# Altium schematic sheet C-08 SODIMM.SchDoc
size 513 x 386 mm
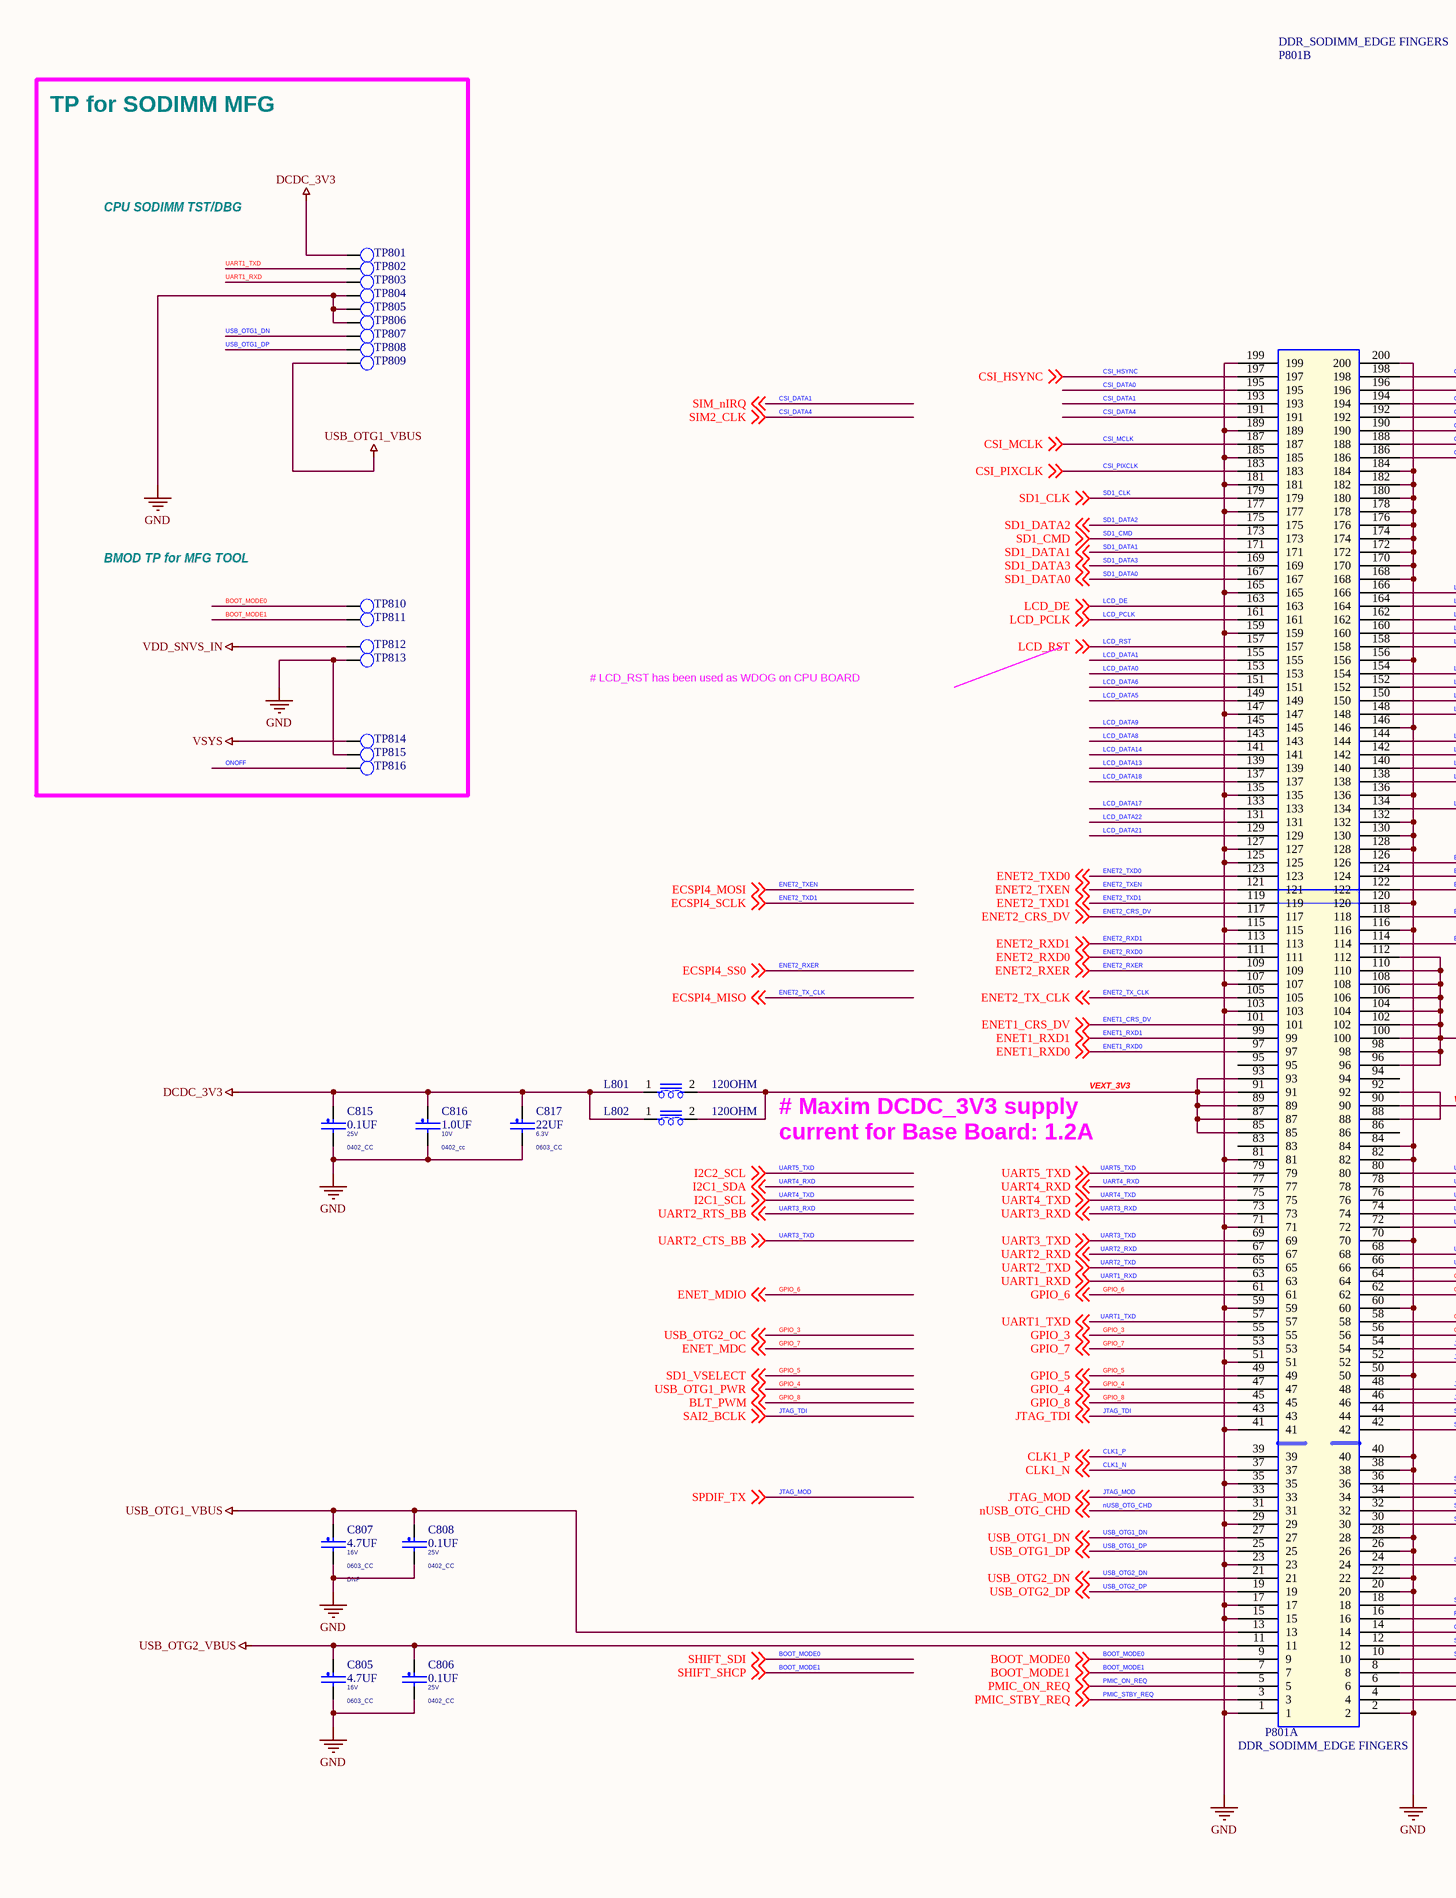
[diagram p0: C-08 SODIMM.SchDoc, left]
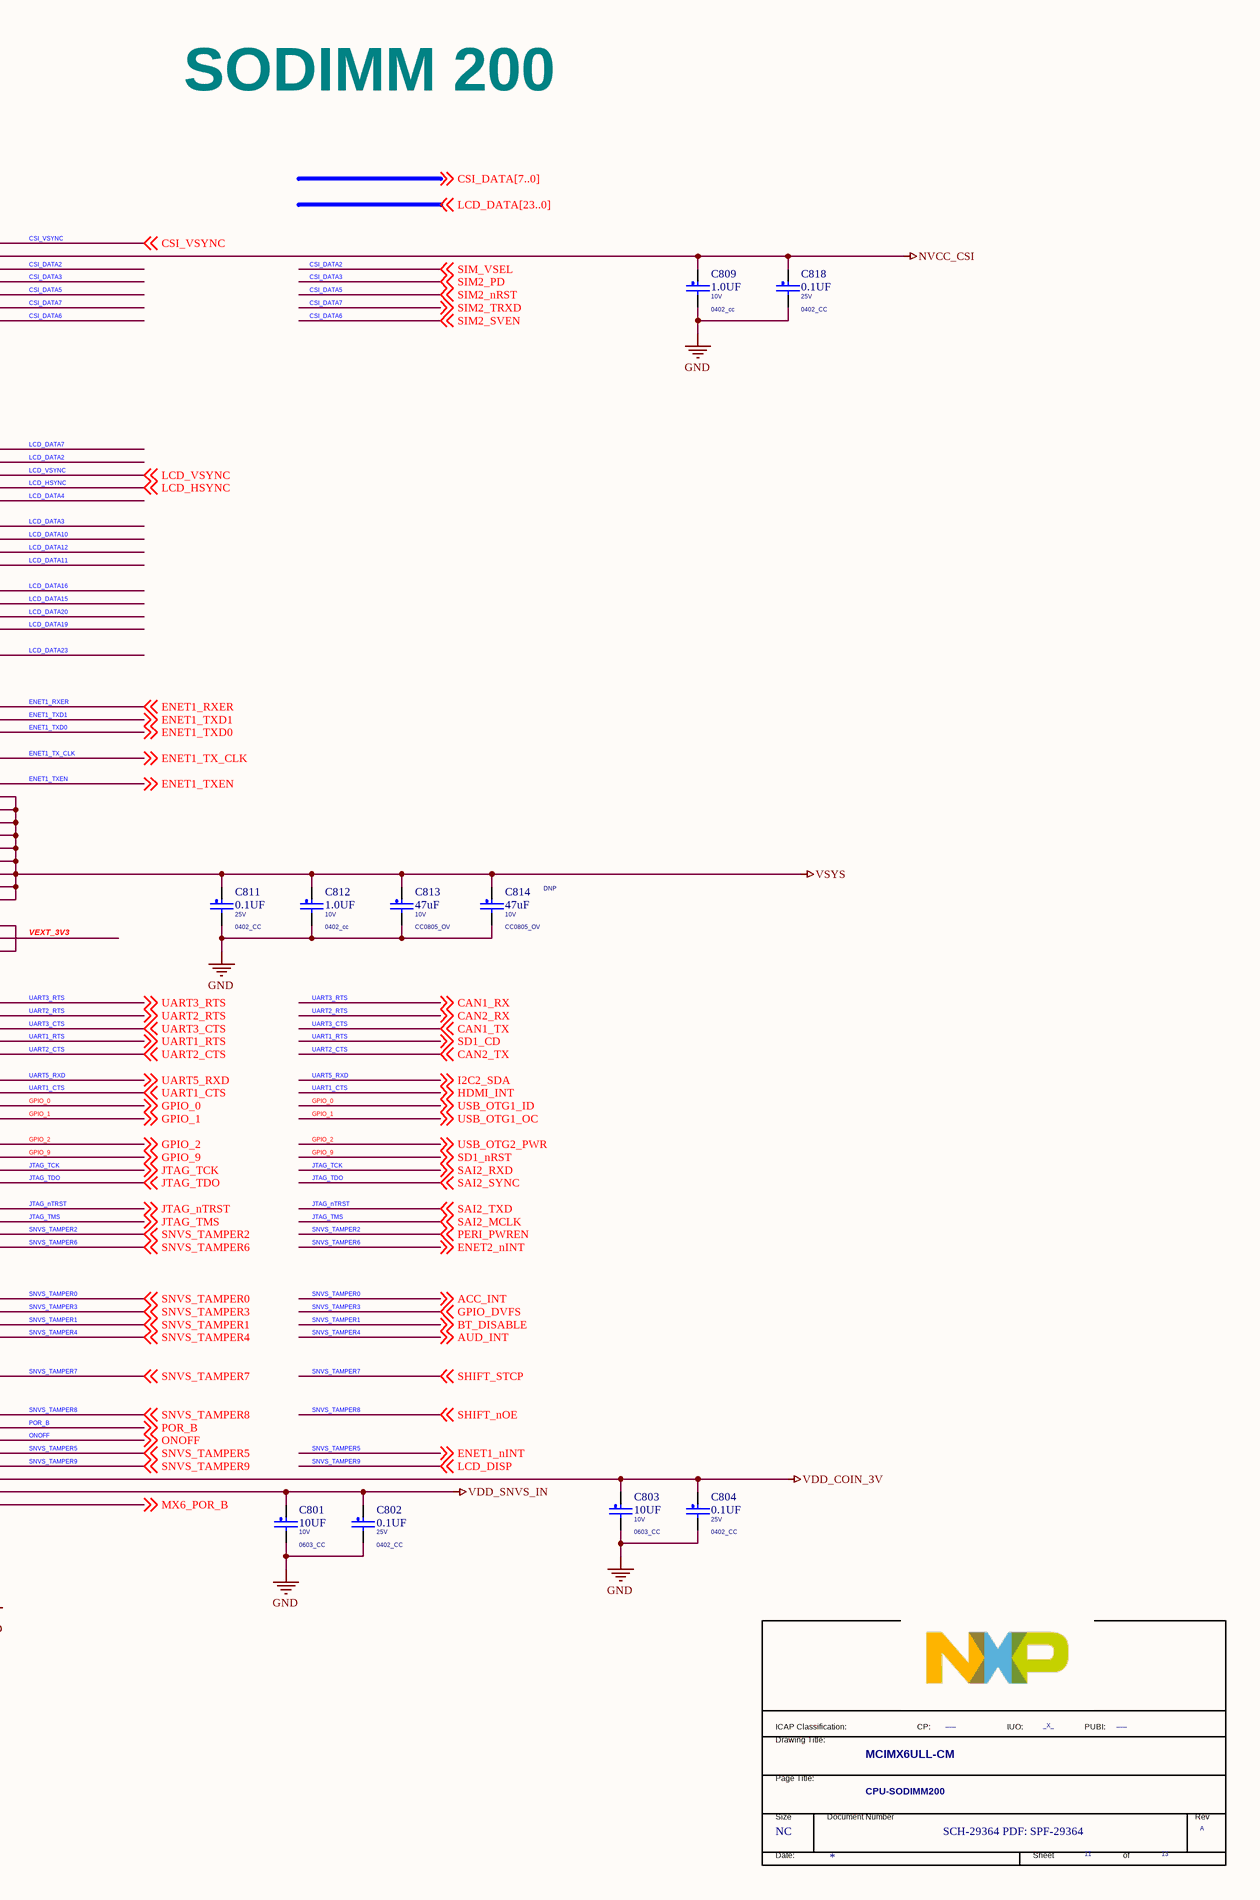
[diagram p1: C-08 SODIMM.SchDoc, right]

## Parts
*  FIUO: _X_  PUBI: ___  Doc: SCH-29364 PDF: SPF-29364  RevCode: A  Title: MCIMX6ULL-CM  Page Size: NC  Page Number: 11  Page Count: 13  PageTitle: CPU-SODIMM200  (hidden comment: TitleBlock_FS)  (graphical)
C801  10UF  VOLTAGE: 10V  PCB Footprint: 0603_CC  [C0603_H0.8mm_IPC_C]
C802  0.1UF  VOLTAGE: 25V  PCB Footprint: 0402_CC  [C0402_H0.5mm]
C803  10UF  VOLTAGE: 10V  PCB Footprint: 0603_CC  [C0603_H0.8mm_IPC_C]
C804  0.1UF  VOLTAGE: 25V  PCB Footprint: 0402_CC  [C0402_H0.5mm]
C805  4.7UF  VOLTAGE: 16V  PCB Footprint: 0603_CC  [C0603_H0.8mm_IPC_C]
C806  0.1UF  VOLTAGE: 25V  PCB Footprint: 0402_CC  [C0402_H0.5mm]
C807  4.7UF  PCB Footprint: 0603_CC  VOLTAGE: 16V  ASSY_OPT: DNP  [C0603_H0.8mm_IPC_C]
C808  0.1UF  VOLTAGE: 25V  PCB Footprint: 0402_CC  [C0402_H0.5mm]
C809  1.0UF  VOLTAGE: 10V  PCB Footprint: 0402_cc  [C0402_H0.5mm]
C811  0.1UF  VOLTAGE: 25V  PCB Footprint: 0402_CC  [C0402_H0.5mm]
C812  1.0UF  VOLTAGE: 10V  PCB Footprint: 0402_cc  [C0402_H0.5mm]
C813  47uF  VOLTAGE: 10V  [CC0805_OV]
C814  47uF  VOLTAGE: 10V  ASSY_OPT: DNP  [CC0805_OV]
C815  0.1UF  VOLTAGE: 25V  PCB Footprint: 0402_CC  [C0402_H0.5mm]
C816  1.0UF  VOLTAGE: 10V  PCB Footprint: 0402_cc  [C0402_H0.5mm]
C817  22UF  voltage rating: 6.3V  PCB Footprint: 0603_CC  [C0603_H0.8mm_IPC_C]
C818  0.1UF  VOLTAGE: 25V  PCB Footprint: 0402_CC  [C0402_H0.5mm]
L801  120OHM  [0603_CC]
L802  120OHM  [0603_CC]
P801  DDR_SODIMM_EDGE FINGERS  [SODIMM_67589]  (parts A,B of 2)
TP801  TP_35MIL  [testpoint_35mil]  (value not drawn)
TP802  TP_35MIL  [testpoint_35mil]  (value not drawn)
TP803  TP_35MIL  [testpoint_35mil]  (value not drawn)
TP804  TP_35MIL  [testpoint_35mil]  (value not drawn)
TP805  TP_35MIL  [testpoint_35mil]  (value not drawn)
TP806  TP_35MIL  [testpoint_35mil]  (value not drawn)
TP807  TP_35MIL  [testpoint_35mil]  (value not drawn)
TP808  TP_35MIL  [testpoint_35mil]  (value not drawn)
TP809  TP_35MIL  [testpoint_35mil]  (value not drawn)
TP810  TP_35MIL  [testpoint_35mil]  (value not drawn)
TP811  TP_35MIL  [testpoint_35mil]  (value not drawn)
TP812  TP_35MIL  [testpoint_35mil]  (value not drawn)
TP813  TP_35MIL  [testpoint_35mil]  (value not drawn)
TP814  TP_35MIL  [testpoint_35mil]  (value not drawn)
TP815  TP_35MIL  [testpoint_35mil]  (value not drawn)
TP816  TP_35MIL  [testpoint_35mil]  (value not drawn)

## Blocks framed on the sheet
TP for SODIMM MFG: TP801-TP816

## Nets
DCDC_3V3: C815.1 C816.1 C817.1 L801.1 L802.1 TP801.1(TP)
GND: C801.2 C802.2 C803.2 C804.2 C805.2 C806.2 C807.2 C808.2 C809.2 C811.2 C812.2 C813.2 C814.2 C815.2 C816.2 C817.2 C818.2 P801.1 P801.2 P801.15 P801.17 P801.20 P801.22 P801.23 P801.26 P801.28 P801.29 P801.35 P801.38 P801.40 P801.41 P801.50 P801.51 P801.59 P801.60 P801.70 P801.71 P801.81 P801.82 P801.84 P801.103 P801.107 P801.115 P801.116 P801.120 P801.125 P801.127 P801.128 P801.130 P801.132 P801.135 P801.136 P801.146 P801.147 P801.156 P801.159 P801.165 P801.168 P801.170 P801.172 P801.174 P801.176 P801.177 P801.178 P801.180 P801.181 P801.182 P801.184 P801.185 P801.189 P801.199 P801.200 TP804.1(TP) TP805.1(TP) TP806.1(TP) TP813.1(TP) TP815.1(TP)
NVCC_CSI: C809.1 C818.1 P801.196
USB_OTG1_VBUS: C807.1 C808.1 P801.13 TP809.1(TP)
USB_OTG2_VBUS: C805.1 C806.1 P801.11
VDD_COIN_3V: C803.1 C804.1 P801.8
VDD_SNVS_IN: C801.1 C802.1 P801.6 TP812.1(TP)
VSYS: C811.1 C812.1 C813.1 C814.1 P801.96 P801.98 P801.100 P801.102 P801.104 P801.106 P801.108 P801.110 P801.112 TP814.1(TP)
BOOT_MODE0: P801.9 TP810.1(TP) ; off-sheet SHIFT_SDI, off-sheet BOOT_MODE0  [also labelled SHIFT_SDI]
BOOT_MODE1: P801.7 TP811.1(TP) ; off-sheet SHIFT_SHCP, off-sheet BOOT_MODE1  [also labelled SHIFT_SHCP]
CLK1_N: P801.37 ; off-sheet CLK1_N
CLK1_P: P801.39 ; off-sheet CLK1_P
CSI_DATA0: P801.195
CSI_DATA1: P801.193 ; off-sheet SIM_nIRQ  [also labelled SIM_nIRQ]
CSI_DATA2: P801.194 ; off-sheet SIM_VSEL  [also labelled SIM_VSEL]
CSI_DATA3: P801.192 ; off-sheet SIM2_PD  [also labelled SIM2_PD]
CSI_DATA4: P801.191 ; off-sheet SIM2_CLK  [also labelled SIM2_CLK]
CSI_DATA5: P801.190 ; off-sheet SIM2_nRST  [also labelled SIM2_nRST]
CSI_DATA6: P801.186 ; off-sheet SIM2_SVEN  [also labelled SIM2_SVEN]
CSI_DATA7: P801.188 ; off-sheet SIM2_TRXD  [also labelled SIM2_TRXD]
CSI_HSYNC: P801.197 ; off-sheet CSI_HSYNC
CSI_MCLK: P801.187 ; off-sheet CSI_MCLK
CSI_PIXCLK: P801.183 ; off-sheet CSI_PIXCLK
CSI_VSYNC: P801.198 ; off-sheet CSI_VSYNC
ENET1_CRS_DV: P801.101 ; off-sheet ENET1_CRS_DV
ENET1_RXD0: P801.97 ; off-sheet ENET1_RXD0
ENET1_RXD1: P801.99 ; off-sheet ENET1_RXD1
ENET1_RXER: P801.126 ; off-sheet ENET1_RXER
ENET1_TX_CLK: P801.118 ; off-sheet ENET1_TX_CLK
ENET1_TXD0: P801.122 ; off-sheet ENET1_TXD0
ENET1_TXD1: P801.124 ; off-sheet ENET1_TXD1
ENET1_TXEN: P801.114 ; off-sheet ENET1_TXEN
ENET2_CRS_DV: P801.117 ; off-sheet ENET2_CRS_DV
ENET2_RXD0: P801.111 ; off-sheet ENET2_RXD0
ENET2_RXD1: P801.113 ; off-sheet ENET2_RXD1
ENET2_RXER: P801.109 ; off-sheet ECSPI4_SS0, off-sheet ENET2_RXER  [also labelled ECSPI4_SS0]
ENET2_TX_CLK: P801.105 ; off-sheet ECSPI4_MISO, off-sheet ENET2_TX_CLK  [also labelled ECSPI4_MISO]
ENET2_TXD0: P801.123 ; off-sheet ENET2_TXD0
ENET2_TXD1: P801.119 ; off-sheet ECSPI4_SCLK, off-sheet ENET2_TXD1  [also labelled ECSPI4_SCLK]
ENET2_TXEN: P801.121 ; off-sheet ECSPI4_MOSI, off-sheet ENET2_TXEN  [also labelled ECSPI4_MOSI]
GPIO_0: P801.64 ; off-sheet USB_OTG1_ID, off-sheet GPIO_0  [also labelled USB_OTG1_ID]
GPIO_1: P801.62 ; off-sheet USB_OTG1_OC, off-sheet GPIO_1  [also labelled USB_OTG1_OC]
GPIO_2: P801.58 ; off-sheet USB_OTG2_PWR, off-sheet GPIO_2  [also labelled USB_OTG2_PWR]
GPIO_3: P801.55 ; off-sheet GPIO_3, off-sheet USB_OTG2_OC  [also labelled USB_OTG2_OC]
GPIO_4: P801.47 ; off-sheet GPIO_4, off-sheet USB_OTG1_PWR  [also labelled USB_OTG1_PWR]
GPIO_5: P801.49 ; off-sheet GPIO_5, off-sheet SD1_VSELECT  [also labelled SD1_VSELECT]
GPIO_6: P801.61 ; off-sheet GPIO_6, off-sheet ENET_MDIO  [also labelled ENET_MDIO]
GPIO_7: P801.53 ; off-sheet GPIO_7, off-sheet ENET_MDC  [also labelled ENET_MDC]
GPIO_8: P801.45 ; off-sheet GPIO_8, off-sheet BLT_PWM  [also labelled BLT_PWM]
GPIO_9: P801.56 ; off-sheet SD1_nRST, off-sheet GPIO_9  [also labelled SD1_nRST]
JTAG_MOD: P801.33 ; off-sheet JTAG_MOD, off-sheet SPDIF_TX  [also labelled SPDIF_TX]
JTAG_nTRST: P801.48 ; off-sheet SAI2_TXD, off-sheet JTAG_nTRST  [also labelled SAI2_TXD]
JTAG_TCK: P801.54 ; off-sheet SAI2_RXD, off-sheet JTAG_TCK  [also labelled SAI2_RXD]
JTAG_TDI: P801.43 ; off-sheet JTAG_TDI, off-sheet SAI2_BCLK  [also labelled SAI2_BCLK]
JTAG_TDO: P801.52 ; off-sheet SAI2_SYNC, off-sheet JTAG_TDO  [also labelled SAI2_SYNC]
JTAG_TMS: P801.46 ; off-sheet SAI2_MCLK, off-sheet JTAG_TMS  [also labelled SAI2_MCLK]
LCD_DATA0: P801.153
LCD_DATA1: P801.155
LCD_DATA2: P801.164
LCD_DATA3: P801.154
LCD_DATA4: P801.158
LCD_DATA5: P801.149
LCD_DATA6: P801.151
LCD_DATA7: P801.166
LCD_DATA8: P801.143
LCD_DATA9: P801.145
LCD_DATA10: P801.152
LCD_DATA11: P801.148
LCD_DATA12: P801.150
LCD_DATA13: P801.139
LCD_DATA14: P801.141
LCD_DATA15: P801.142
LCD_DATA16: P801.144
LCD_DATA17: P801.133
LCD_DATA18: P801.137
LCD_DATA19: P801.138
LCD_DATA20: P801.140
LCD_DATA21: P801.129
LCD_DATA22: P801.131
LCD_DATA23: P801.134
LCD_DE: P801.163 ; off-sheet LCD_DE
LCD_HSYNC: P801.160 ; off-sheet LCD_HSYNC
LCD_PCLK: P801.161 ; off-sheet LCD_PCLK
LCD_RST: P801.157 ; off-sheet LCD_RST
LCD_VSYNC: P801.162 ; off-sheet LCD_VSYNC
MX6_POR_B: P801.4 ; off-sheet MX6_POR_B
nUSB_OTG_CHD: P801.31 ; off-sheet nUSB_OTG_CHD
ONOFF: P801.14 TP816.1(TP) ; off-sheet ONOFF
PMIC_ON_REQ: P801.5 ; off-sheet PMIC_ON_REQ
PMIC_STBY_REQ: P801.3 ; off-sheet PMIC_STBY_REQ
POR_B: P801.16 ; off-sheet POR_B
SD1_CLK: P801.179 ; off-sheet SD1_CLK
SD1_CMD: P801.173 ; off-sheet SD1_CMD
SD1_DATA0: P801.167 ; off-sheet SD1_DATA0
SD1_DATA1: P801.171 ; off-sheet SD1_DATA1
SD1_DATA2: P801.175 ; off-sheet SD1_DATA2
SD1_DATA3: P801.169 ; off-sheet SD1_DATA3
SNVS_TAMPER0: P801.36 ; off-sheet ACC_INT, off-sheet SNVS_TAMPER0  [also labelled ACC_INT]
SNVS_TAMPER1: P801.32 ; off-sheet BT_DISABLE, off-sheet SNVS_TAMPER1  [also labelled BT_DISABLE]
SNVS_TAMPER2: P801.44 ; off-sheet PERI_PWREN, off-sheet SNVS_TAMPER2  [also labelled PERI_PWREN]
SNVS_TAMPER3: P801.34 ; off-sheet GPIO_DVFS, off-sheet SNVS_TAMPER3  [also labelled GPIO_DVFS]
SNVS_TAMPER4: P801.30 ; off-sheet AUD_INT, off-sheet SNVS_TAMPER4  [also labelled AUD_INT]
SNVS_TAMPER5: P801.12 ; off-sheet ENET1_nINT, off-sheet SNVS_TAMPER5  [also labelled ENET1_nINT]
SNVS_TAMPER6: P801.42 ; off-sheet ENET2_nINT, off-sheet SNVS_TAMPER6  [also labelled ENET2_nINT]
SNVS_TAMPER7: P801.24 ; off-sheet SHIFT_STCP, off-sheet SNVS_TAMPER7  [also labelled SHIFT_STCP]
SNVS_TAMPER8: P801.18 ; off-sheet SHIFT_nOE, off-sheet SNVS_TAMPER8  [also labelled SHIFT_nOE]
SNVS_TAMPER9: P801.10 ; off-sheet LCD_DISP, off-sheet SNVS_TAMPER9  [also labelled LCD_DISP]
UART1_CTS: P801.66 ; off-sheet HDMI_INT, off-sheet UART1_CTS  [also labelled HDMI_INT]
UART1_RTS: P801.74 ; off-sheet SD1_CD, off-sheet UART1_RTS  [also labelled SD1_CD]
UART1_RXD: P801.63 TP803.1(TP) ; off-sheet UART1_RXD
UART1_TXD: P801.57 TP802.1(TP) ; off-sheet UART1_TXD
UART2_CTS: P801.72 ; off-sheet CAN2_TX, off-sheet UART2_CTS  [also labelled CAN2_TX]
UART2_RTS: P801.78 ; off-sheet CAN2_RX, off-sheet UART2_RTS  [also labelled CAN2_RX]
UART2_RXD: P801.67 ; off-sheet UART2_RXD
UART2_TXD: P801.65 ; off-sheet UART2_TXD
UART3_CTS: P801.76 ; off-sheet CAN1_TX, off-sheet UART3_CTS  [also labelled CAN1_TX]
UART3_RTS: P801.80 ; off-sheet CAN1_RX, off-sheet UART3_RTS  [also labelled CAN1_RX]
UART3_RXD: P801.73 ; off-sheet UART3_RXD, off-sheet UART2_RTS_BB  [also labelled UART2_RTS_BB]
UART3_TXD: P801.69 ; off-sheet UART3_TXD, off-sheet UART2_CTS_BB  [also labelled UART2_CTS_BB]
UART4_RXD: P801.77 ; off-sheet I2C1_SDA, off-sheet UART4_RXD  [also labelled I2C1_SDA]
UART4_TXD: P801.75 ; off-sheet UART4_TXD, off-sheet I2C1_SCL  [also labelled I2C1_SCL]
UART5_RXD: P801.68 ; off-sheet I2C2_SDA, off-sheet UART5_RXD  [also labelled I2C2_SDA]
UART5_TXD: P801.79 ; off-sheet UART5_TXD, off-sheet I2C2_SCL  [also labelled I2C2_SCL]
USB_OTG1_DN: P801.27 TP807.1(TP) ; off-sheet USB_OTG1_DN
USB_OTG1_DP: P801.25 TP808.1(TP) ; off-sheet USB_OTG1_DP
USB_OTG2_DN: P801.21 ; off-sheet USB_OTG2_DN
USB_OTG2_DP: P801.19 ; off-sheet USB_OTG2_DP
VEXT_3V3: L801.2 L802.2 P801.85 P801.87 P801.89 P801.90 P801.91 P801.93
NetP801_88: P801.88 P801.92

Not connected (* = marked no-connect by the designer): P801 83 86 94 95

## Notes on the sheet
- CPU SODIMM TST/DBG
- SODIMM 200
- BMOD TP for MFG TOOL
- # LCD_RST has been used as WDOG on CPU BOARD
- # Maxim DCDC_3V3 supply
  current for Base Board: 1.2A
- (in symbol TitleBlock_FS) ICAP Classification:; CP:; IUO:; PUBI:; Drawing Title:; Page Title:; Size; Document Number; Rev; Date:; Sheet; of

## Library data of the parts
* = TitleBlock_FS: OrgAddr2: Austin, TX 78735-8598; OrgAddr1: 6501 William Cannon Drive West; OrgName: Freescale Semiconductor; FCP: ___; Page Create Date: March  8, 1995; Page Modify Date: *
C801 C803 = CAP_NP: CAP CER 10UF 10V 20% X5R 0603; CLASS: DISCRETE; FPLIST: CC0603_OV,CC0603,0603_CC; CAD_APPROVED: Yes; MFG_PN01: LMK107BJ106MALTD; MFG_NAME01: TAIYO YUDEN; AGILE_PN: 150-78609; HEIGHT: 1.016MM; ROHS: Yes
C802 C804 C806 C808 = CAP_NP: CAP CER 0.1UF 25V 10% X5R 0402; CLASS: DISCRETE; AGILE_PN: 150-78633; MFG_NAME01: YAGEO AMERICA; MFG_PN01: CC0402KRX5R8BB104; CAD_APPROVED: Yes; FPLIST: CC0402_25,CC0402_HD,0402_CC; Tolerance: 10%; ROHS: Yes; HEIGHT: 0.55MM
C805 = CAP_NP: CAP CER 4.7uF 16V 10% X5R 0603; CLASS: DISCRETE; AGILE_PN: 150-78976; MFG_NAME01: TDK; MFG_PN01: C1608X5R1C475K; CAD_APPROVED: Yes; FPLIST: CC0603_OV,CC0603,0603_CC; Tolerance: 10%; ROHS: Yes; HEIGHT: 0.9 MM
C807 = CAP_NP: CAP CER 4.7uF 16V 10% X5R 0603; CLASS: DISCRETE; FPLIST: CC0603_OV,CC0603,0603_CC; CAD_APPROVED: Yes; MFG_PN01: C1608X5R1C475K; MFG_NAME01: TDK; AGILE_PN: 150-78976; HEIGHT: 0.9 MM; ROHS: Yes; Tolerance: 10%
C809 C812 C816 = CAP_NP: CAP CER 1.0UF 10V 10% X5R 0402; CLASS: DISCRETE; AGILE_PN: 150-75772; MFG_NAME01: YAGEO AMERICA; MFG_PN01: CC0402KRX5R6BB105; CAD_APPROVED: Yes; FPLIST: CC0402_25,CC0402_HD,0402_CC; ROHS: Yes; HEIGHT: 0.6MM
C811 C815 C818 = CAP_NP: CAP CER 0.1UF 25V 10% X5R 0402; CLASS: DISCRETE; FPLIST: CC0402_25,CC0402_HD,0402_CC; CAD_APPROVED: Yes; MFG_PN01: CC0402KRX5R8BB104; MFG_NAME01: YAGEO AMERICA; AGILE_PN: 150-78633; HEIGHT: 0.55MM; ROHS: Yes; Tolerance: 10%
C813 C814 = CAP_NP: CAP CER 47uF 10V 20% X5R 0805; CLASS: DISCRETE; FPLIST: CC0805_OV,CC0805,0805_CC; CAD_APPROVED: Yes; MFG_PN01: C2012X5R1A476M; MFG_NAME01: TDK; AGILE_PN: 150-78979; HEIGHT: 1.45 MM; ROHS: Yes; Tolerance: 20%; PCB Footprint: CC0805_OV
C817 = CAP_NP: CAP CER 22UF 6.3V 20% X5R 0603; CLASS: DISCRETE; FPLIST: CC0603_OV,CC0603,0603_CC; CAD_APPROVED: Yes; MFG_PN01: CL10A226MQ8NRNE; MFG_NAME01: Samsung; AGILE_PN: 150-78467; VOLTAGE: 6.3V; HEIGHT: 1MM; ROHS: Yes; Tolerance: 20%
L801 = BEAD_0: IND FER BEAD 120OHM@100MHZ 2A 25% 0603; PART_TYPE: FERRITE; CLASS: DISCRETE; FPLIST: IND_0603,0603_CC; CAD_APPROVED: Yes; MFG_PN01: BLM18PG121SH1; MFG_NAME01: MURATA; AGILE_PN: 180-30008; HEIGHT: 0.95MM; ROHS: Yes; Tolerance: 25%; PCB Footprint: 0603_CC
L802 = BEAD_0: IND FER BEAD 120OHM@100MHZ 2A 25% 0603; PART_TYPE: FERRITE; CLASS: DISCRETE; AGILE_PN: 180-30008; MFG_NAME01: MURATA; MFG_PN01: BLM18PG121SH1; CAD_APPROVED: Yes; FPLIST: IND_0603,0603_CC; Tolerance: 25%; ROHS: Yes; HEIGHT: 0.95MM; PCB Footprint: 0603_CC
P801 = CONN_EDGE_200P: 200 PIN SODIMM EDGE FINGERS -- AU FOOTPRINT ONLY, NO PART TO ORDER; CLASS: IO; AGILE_PN: 211-75329; MFG_NAME01: GENERIC; MFG_PN01: 200SODIMM_EDGEFINGER; CAD_APPROVED: Yes; ROHS: Yes; HEIGHT: N/A; PCB Footprint: SODIMM_67589
TP801-TP810 TP814-TP816 = T POINT R: TEST POINT PAD .035 SMT, no part to order; CLASS: IC; CAD_APPROVED: Yes; AGILE_PN: 510-75618; PCB Footprint: testpoint_35mil; HEIGHT: 0.1MM; ROHS: Yes
TP811-TP813 = T POINT R: TEST POINT PAD .035 SMT, no part to order; CLASS: IC; AGILE_PN: 510-75618; CAD_APPROVED: Yes; PCB Footprint: testpoint_35mil; ROHS: Yes; HEIGHT: 0.1MM